# EAGLE design rc64kram62256ram (EAGLE 9.6.2)
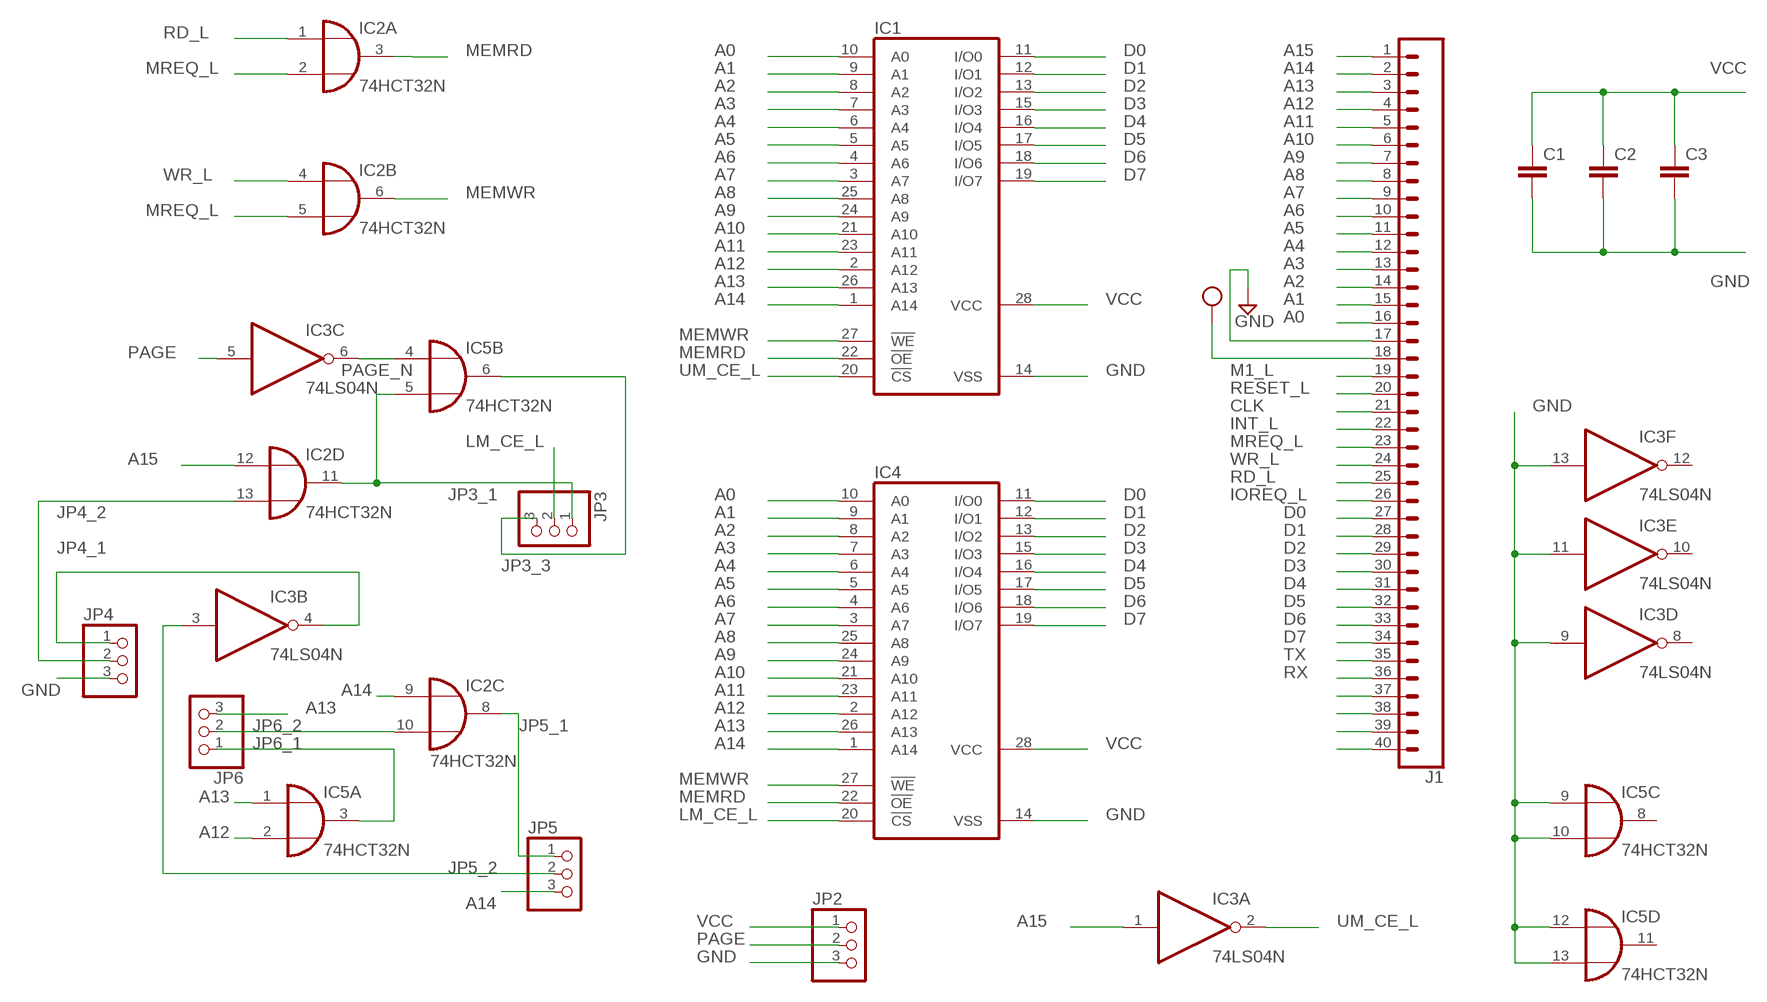
[diagram p0: schematic, sheet 1]

## Parts
C1  C-EU050-025X075  [C050-025X075]
C2  C-EU050-025X075  [C050-025X075]
C3  C-EU050-025X075  [C050-025X075]
IC1  62256P  [DIL28-6]
IC2  74HCT32N  [DIL14]
IC3  74LS04N  [DIL14]
IC4  62256P  [DIL28-6]
IC5  74HCT32N  [DIL14]
J1  CONN_40OFFSET  [1X40_OFFSET]
JP2  PINHD-1X3  [1X03]
JP3  PINHD-1X3  [1X03]
JP4  PINHD-1X3  [1X03]
JP5  PINHD-1X3  [1X03]
JP6  PINHD-1X3  [1X03]

## Nets
A0: IC1.10(A0) IC4.10(A0) J1.16
A1: IC1.9(A1) IC4.9(A1) J1.15
A2: IC1.8(A2) IC4.8(A2) J1.14
A3: IC1.7(A3) IC4.7(A3) J1.13
A4: IC1.6(A4) IC4.6(A4) J1.12
A5: IC1.5(A5) IC4.5(A5) J1.11
A6: IC1.4(A6) IC4.4(A6) J1.10
A7: IC1.3(A7) IC4.3(A7) J1.9
A8: IC1.25(A8) IC4.25(A8) J1.8
A9: IC1.24(A9) IC4.24(A9) J1.7
A10: IC1.21(A10) IC4.21(A10) J1.6
A11: IC1.23(A11) IC4.23(A11) J1.5
A12: IC1.2(A12) IC4.2(A12) IC5.2(A:I1) J1.4
A13: IC1.26(A13) IC4.26(A13) IC5.1(A:I0) J1.3 JP6.3
A14: IC1.1(A14) IC2.9(C:I0) IC4.1(A14) J1.2 JP5.3
A15: IC2.12(D:I0) IC3.1(A:I) J1.1
CLK: J1.21
D0: IC1.11(I/O0) IC4.11(I/O0) J1.27
D1: IC1.12(I/O1) IC4.12(I/O1) J1.28
D2: IC1.13(I/O2) IC4.13(I/O2) J1.29
D3: IC1.15(I/O3) IC4.15(I/O3) J1.30
D4: IC1.16(I/O4) IC4.16(I/O4) J1.31
D5: IC1.17(I/O5) IC4.17(I/O5) J1.32
D6: IC1.18(I/O6) IC4.18(I/O6) J1.33
D7: IC1.19(I/O7) IC4.19(I/O7) J1.34
GND: C1.2 C2.2 C3.2 IC1.14(VSS) IC3.9(D:I) IC3.11(E:I) IC3.13(F:I) IC4.14(VSS) IC5.9(C:I0) IC5.10(C:I1) IC5.12(D:I0) IC5.13(D:I1) J1.17 JP2.3 JP4.3
INT_L: J1.22
IOREQ_L: J1.26
JP3_1: IC2.11(D:O) IC5.5(B:I1) JP3.1
JP3_3: IC5.6(B:O) JP3.3
JP4_1: IC3.4(B:O) JP4.1
JP4_2: IC2.13(D:I1) JP4.2
JP5_1: IC2.8(C:O) JP5.1
JP5_2: IC3.3(B:I) JP5.2
JP6_1: IC5.3(A:O) JP6.1
JP6_2: IC2.10(C:I1) JP6.2
LM_CE_L: IC4.20(!CS) JP3.2
M1_L: J1.19
MEMRD: IC1.22(!OE) IC2.3(A:O) IC4.22(!OE)
MEMWR: IC1.27(!WE) IC2.6(B:O) IC4.27(!WE)
MREQ_L: IC2.2(A:I1) IC2.5(B:I1) J1.23
N$1: J1.37
N$2: J1.38
N$3: J1.39
N$13: J1.40
PAGE: IC3.5(C:I) JP2.2
PAGE_N: IC3.6(C:O) IC5.4(B:I0)
RD_L: IC2.1(A:I0) J1.25
RESET_L: J1.20
RX: J1.36
TX: J1.35
UM_CE_L: IC1.20(!CS) IC3.2(A:O)
VCC: C1.1 C2.1 C3.1 IC1.28(VCC) IC4.28(VCC) J1.18 JP2.1
WR_L: IC2.4(B:I0) J1.24
Unconnected: IC3.8(D:O) IC3.10(E:O) IC3.12(F:O) IC5.8(C:O) IC5.11(D:O)

## Power pins joined to a net without a drawn wire
GND: IC2.7(P:GND) IC3.7(P:GND) IC5.7(P:GND)
VCC: IC2.14(P:VCC) IC3.14(P:VCC) IC5.14(P:VCC)

## Library data of the parts
C1-C3 = LabE:C-EU: CAPACITOR, European symbol; SPICEPREFIX: C
IC1 IC4 = memory-hitachi:62256P: MEMORY; OC_FARNELL: unknown; OC_NEWARK: unknown
IC2 IC5 = 74xx-eu:74*32: Quad 2-input OR gate
IC3 = 74xx-eu:74*04: Hex INVERTER
J1 = SparkFun-Connectors:CONN_40: Multi connection point. Often used as Generic Header-pin footprint for 0.1 inch spaced/style header connections On any of the 0.1 inch spaced packages, you can populate with these: Break Away Headers - Straight <https://www.sparkfun.com/products/116> (PRT-00116) Break Away Male Headers - Right Angle <https://www.sparkfun.com/products/553> (PRT-00553) Female Headers <https://www.sparkfun.com/products/115> (PRT-00115) Break Away Headers - Machine Pin <https://www.sparkfun.com/products/117> (PRT-00117) Break Away Female Headers - Swiss Machine Pin <https://www.sparkfun.com/products/743> (PRT-00743) For SCREWTERMINALS and SPRING TERMINALS visit here: Screw Terimnals on SparkFun.com <https://www.sparkfun.com/search/results?term=Screw+Terminals> (5mm/3.5mm/2.54mm spacing) This device is also useful as a general connection point to wire up your design to another part of your project. Our various solder wires solder well into these plated through hole pads. Hook-Up Wire - Assortment (Stranded, 22 AWG) <https://www.sparkfun.com/products/11375> (PRT-11375) Hook-Up Wire - Assortment (Solid Core, 22 AWG) <https://www.sparkfun.com/products/11367> (PRT-11367) View the entire wire category on our website here <https://www.sparkfun.com/categories/141> Special notes: Molex polarized connector foot print use with SKU : PRT-08231 with associated crimp pins and housings. 1MM SMD Version SKU: PRT-10208 NOTES ON THE VARIANTS LOCK and LOCK_LONGPADS... This footprint was designed to help hold the alignment of a through-hole component (i.e. 6-pin header) while soldering it into place. You may notice that each hole has been shifted either up or down by 0.005 of an inch from it's more standard position (which is a perfectly straight line). This slight alteration caused the pins (the squares in the middle) to touch the edges of the holes. Because they are alternating, it causes a "brace" to hold the component in place. 0.005 has proven to be the perfect amount of "off-center" position when using our standard breakaway headers. Although looks a little odd when you look at the bare footprint, once you have a header in there, the alteration is very hard to notice. Also,if you push a header all the way into place, it is covered up entirely on the bottom side.
JP2-JP6 = pinhead:PINHD-1X3: PIN HEADER

## Board
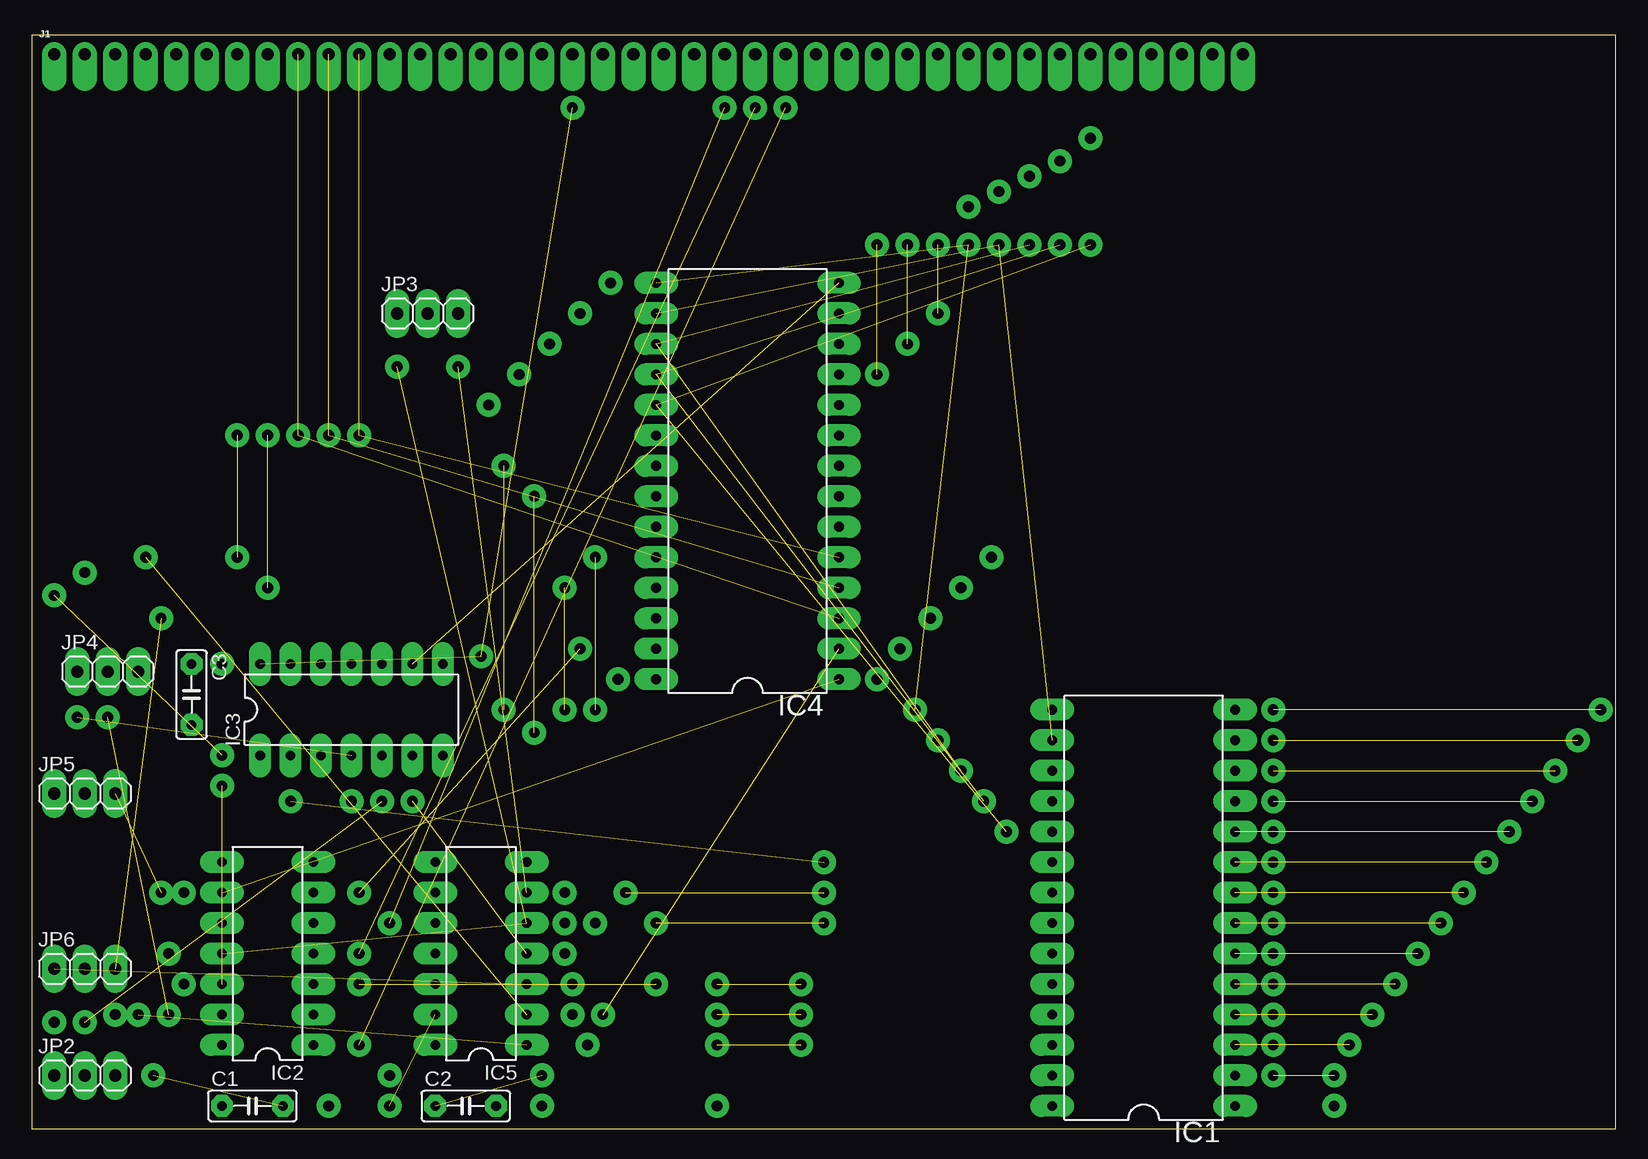
[diagram p1: board, top side]
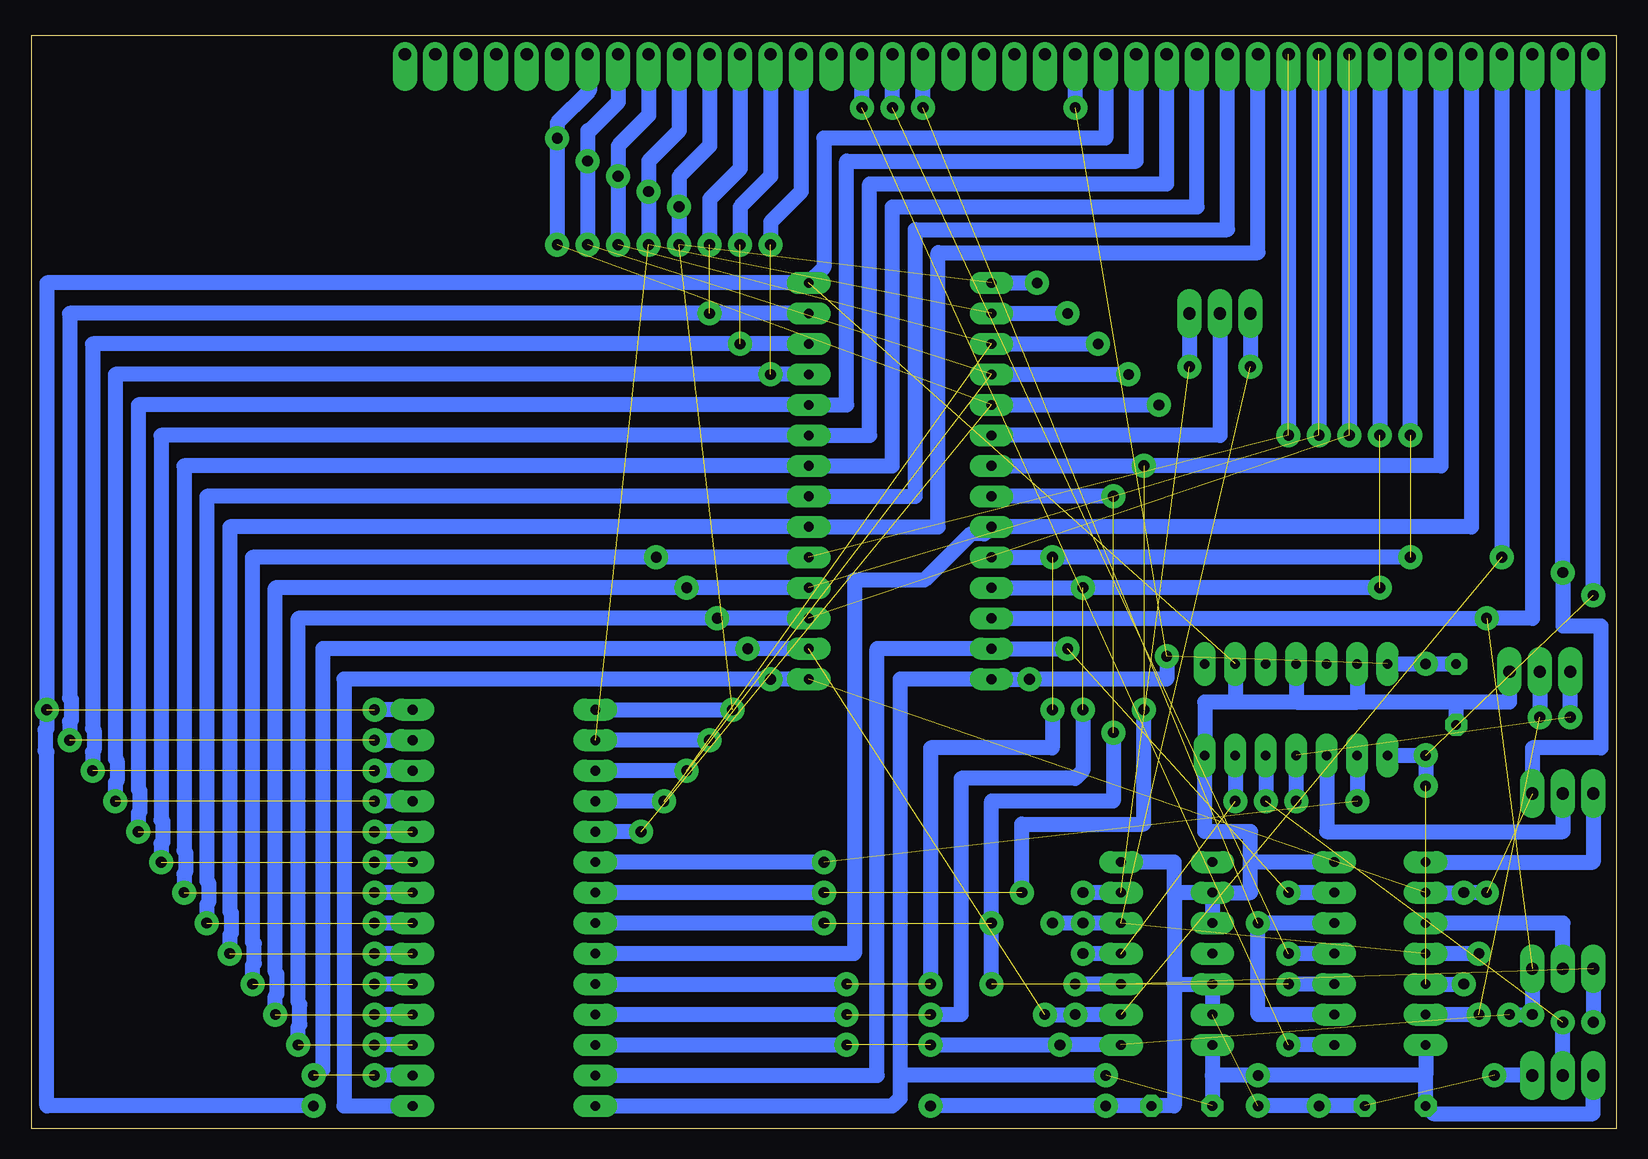
[diagram p2: board, bottom side, seen from below]

Size 132.06 x 91.11 mm. Coordinates in mm from the lower left corner, seen from the top.
Outline: 0,0 132.06,0 132.06,91.11 0,91.11 0,0
Copper layers (1*16): Top 0.035mm / dielectric 1.5mm / Bottom 0.035mm
Design rules "LabE": minimum track width 50mil, minimum drill 0.8mm, track to track 16mil, track to pad 16mil, pad to pad 16mil, via to via 16mil, smd to smd 16mil, copper to edge 0mil, drill to drill 16mil, minimum pad ring 20mil, minimum via ring 20mil, stop-mask expansion 4mil, vias tented up to drill 0mil, thermal gap 10mil

### Footprints (pad centres in the part's own frame; a part is rotated, then mirrored left to right if it is on the bottom)
C050-025X075 = drill 0.813 octagon: 1 -2.54,0; 2 2.54,0
DIL28-6 = drill 0.813 long: 1 -16.51,-7.62; 2 -13.97,-7.62; 3 -11.43,-7.62; 4 -8.89,-7.62; 5 -6.35,-7.62; 6 -3.81,-7.62; 7 -1.27,-7.62; 8 1.27,-7.62; 9 3.81,-7.62; 10 6.35,-7.62; 11 8.89,-7.62; 12 11.43,-7.62; 13 13.97,-7.62; 14 16.51,-7.62; 15 16.51,7.62; 16 13.97,7.62; 17 11.43,7.62; 18 8.89,7.62; 19 6.35,7.62; 20 3.81,7.62; 21 1.27,7.62; 22 -1.27,7.62; 23 -3.81,7.62; 24 -6.35,7.62; 25 -8.89,7.62; 26 -11.43,7.62; 27 -13.97,7.62; 28 -16.51,7.62
DIL14 = drill 0.813 long: 1 -7.62,-3.81; 2 -5.08,-3.81; 3 -2.54,-3.81; 4 0,-3.81; 5 2.54,-3.81; 6 5.08,-3.81; 7 7.62,-3.81; 8 7.62,3.81; 9 5.08,3.81; 10 2.54,3.81; 11 0,3.81; 12 -2.54,3.81; 13 -5.08,3.81; 14 -7.62,3.81
1X40_OFFSET = drill 1.016 pad 1.88 offset: 1 0,0; 2 2.54,0; 3 5.08,0; 4 7.62,0; 5 10.16,0; 6 12.7,0; 7 15.24,0; 8 17.78,0; 9 20.32,0; 10 22.86,0; 11 25.4,0; 12 27.94,0; 13 30.48,0; 14 33.02,0; 15 35.56,0; 16 38.1,0; 17 40.64,0; 18 43.18,0; 19 45.72,0; 20 48.26,0; 21 50.8,0; 22 53.34,0; 23 55.88,0; 24 58.42,0; 25 60.96,0; 26 63.5,0; 27 66.04,0; 28 68.58,0; 29 71.12,0; 30 73.66,0; 31 76.2,0; 32 78.74,0; 33 81.28,0; 34 83.82,0; 35 86.36,0; 36 88.9,0; 37 91.44,0; 38 93.98,0; 39 96.52,0; 40 99.06,0
1X03 = drill 1.016 long: 1 -2.54,0; 2 0,0; 3 2.54,0

### Placement (x,y rotation side)
C1  18.41,1.91 0 top
C2  36.2,1.91 0 top
C3  13.34,36.2 270 top
IC1  92.71,18.41 90 top
IC2  19.68,14.61 90 top
IC3  26.67,34.92 0 top
IC4  59.69,53.98 90 top
IC5  37.47,14.61 90 top
J1  1.91,89.53 0 top
JP2  4.45,4.45 0 top
JP3  33.02,67.94 0 top
JP4  6.35,38.1 0 top
JP5  4.45,27.94 0 top
JP6  4.45,13.34 0 top

### Tracks (layer width: path | path; a pad name or v marks a point on that pad's centre or on a via)
A0  (via drill 0.9 pad 2)  (2 unrouted)
  Bottom 1.27: IC1.10 v103.5,24.77 | J1.16 40.01,80.64 64.14,80.64 64.14,60.33 IC4.10 123.19,60.33 123.19,28.29 123.05,28.15 123.05,26.46 123.19,26.32 v123.19,24.77
A1  (via drill 0.9 pad 2)  (2 unrouted)
  Bottom 1.27: IC1.9 v103.5,22.23 | J1.15 37.47,78.74 62.23,78.74 62.23,57.78 IC4.9 121.28,57.78 121.28,25.75 121.15,25.61 121.15,23.92 121.28,23.78 v121.28,22.23
A2  (via drill 0.9 pad 2)  (2 unrouted)
  Bottom 1.27: IC1.8 v103.5,19.68 | J1.14 34.92,76.83 60.33,76.83 60.33,55.24 IC4.8 119.38,55.24 119.38,23.21 119.24,23.07 119.24,21.38 119.38,21.24 v119.38,19.68
A3  (via drill 0.9 pad 2)  (2 unrouted)
  Bottom 1.27: IC1.7 v103.5,17.14 | J1.13 32.38,74.93 58.42,74.93 58.42,52.7 IC4.7 117.47,52.7 117.47,20.67 117.34,20.53 117.34,18.84 117.47,18.7 v117.47,17.14
A4  (via drill 0.9 pad 2)  (2 unrouted)
  Bottom 1.27: IC1.6 v103.5,14.61 | J1.12 29.84,73.03 56.52,73.03 56.52,50.16 IC4.6 115.57,50.16 115.57,18.13 115.43,17.99 115.43,16.3 115.57,16.16 v115.57,14.61
A5  (via drill 0.9 pad 2)  (5 unrouted)
  Bottom 1.27: IC4.5 v80.01,47.62 113.67,47.62 113.67,15.59 113.53,15.45 113.53,13.76 113.67,13.62 v113.67,12.06 | IC1.5 v103.5,12.06 | J1.11 v27.3,57.78
A6  (via drill 0.9 pad 2)  (5 unrouted)
  Bottom 1.27: IC4.4 v77.47,45.09 111.76,45.09 111.76,13.05 111.62,12.91 111.62,11.22 111.76,11.08 v111.76,9.53 | IC1.4 v103.5,9.53 | J1.10 v24.77,57.78
A7  (via drill 0.9 pad 2)  (5 unrouted)
  Bottom 1.27: IC4.3 v74.93,42.55 109.86,42.55 109.86,10.51 109.72,10.37 109.72,8.68 109.86,8.54 v109.86,6.99 | IC1.3 v103.5,6.99 | J1.9 v22.23,57.78
A8  (via drill 0.9 pad 2)  (3 unrouted)
  Bottom 1.27: J1.8 v19.68,57.78 | v64.14,9.53 IC1.25 | v19.68,45.09 v44.45,45.09 IC4.25 | v44.45,34.92 44.45,29.84 45.09,29.21 54.61,29.21 54.61,9.53 v57.15,9.53
A9  (via drill 0.9 pad 2)  (3 unrouted)
  Bottom 1.27: v17.14,57.78 J1.7 | v17.14,47.62 v46.99,47.62 IC4.24 | IC1.24 v64.14,12.06 | v46.99,34.92 46.99,31.75 57.15,31.75 v57.15,12.06
A10  (via drill 0.9 pad 2)  (2 unrouted)
  Bottom 1.27: J1.6 14.61,55.24 v39.37,55.24 IC4.21 | v66.04,19.68 IC1.21 | v49.53,19.68 49.53,25.4 39.37,25.4 v39.37,34.92
A11
  Bottom 1.27: J1.5 12.06,50.16 IC4.23 52.65,49.58 53.8,49.58 57.66,45.72 63.5,45.72 63.5,14.61 IC1.23
A12  (via drill 0.9 pad 2)  (3 unrouted)
  Bottom 1.27: IC4.2 v72.39,40.01 107.81,40.01 107.81,4.94 108.45,4.31 v108.58,4.45 | IC1.2 v103.5,4.45 | J1.4 v9.53,47.62 | IC5.2 v45.09,9.53 v47.62,9.53
A13  (via drill 0.9 pad 2)  (3 unrouted)
  Bottom 1.27: IC1.26 v64.14,6.99 | J1.3 6.99,42.55 v10.79,42.55 IC4.26 | IC5.1 v46.35,6.99 v57.15,6.99 | JP6.3 v6.99,9.53 v8.89,9.53
A14  (via drill 0.9 pad 2)  (2 unrouted)
  Bottom 1.27: IC4.1 v70.48,37.47 106.05,37.47 106.05,1.91 IC1.1 | J1.2 v4.45,46.35 4.45,41.91 1.27,41.91 1.27,31.75 6.99,31.75 JP5.3 | IC2.9 v12.7,19.68 v10.79,19.68
A15  (via drill 0.9 pad 2)  (2 unrouted)
  Bottom 1.27: v1.91,44.45 J1.1 | IC3.1 v15.88,31.11 v15.88,28.57 | IC2.12 v12.7,12.06
D0  (via drill 0.9 pad 2)  (2 unrouted)
  Bottom 1.27: IC4.11 v70.48,62.87 125.09,62.87 125.09,30.83 124.96,30.69 124.96,29 125.09,28.86 v125.09,27.3 | IC1.11 v103.5,27.3 | J1.27 67.94,78.11 70.48,75.56 v70.48,73.66
D1  (via drill 0.9 pad 2)  (2 unrouted)
  Bottom 1.27: IC4.12 v73.03,65.41 127,65.41 127,33.37 126.86,33.23 126.86,31.54 127,31.4 v127,29.84 | IC1.12 v103.5,29.84 | J1.28 70.48,79.38 73.03,76.83 v73.03,73.66
D2  (via drill 0.9 pad 2)  (2 unrouted)
  Bottom 1.27: IC4.13 v75.56,67.94 128.91,67.94 128.91,35.91 128.77,35.77 128.77,34.08 128.91,33.94 v128.91,32.38 | v103.5,32.38 IC1.13 | v75.56,73.66 75.56,77.47 73.03,80.01 J1.29
D3  (via drill 0.9 pad 2)  (2 unrouted)
  Bottom 1.27: IC4.15 v48.26,70.48 | IC1.15 v73.66,34.92 | J1.30 75.56,81.92 78.11,79.38 v78.11,76.83 v78.11,73.66
D4  (via drill 0.9 pad 2)  (2 unrouted)
  Bottom 1.27: IC4.16 v45.72,67.94 | v75.56,32.38 IC1.16 | J1.31 78.11,83.19 80.64,80.64 v80.64,78.11 v80.64,73.66
D5  (via drill 0.9 pad 2)  (2 unrouted)
  Bottom 1.27: IC4.17 v43.18,65.41 | v77.47,29.84 IC1.17 | J1.32 80.64,84.45 83.19,81.92 v83.19,79.38 v83.19,73.66
D6  (via drill 0.9 pad 2)  (2 unrouted)
  Bottom 1.27: IC4.18 v40.64,62.87 | v79.38,27.3 IC1.18 | J1.33 83.19,85.56 85.56,83.19 85.72,83.19 v85.72,80.64 v85.72,73.66
D7  (via drill 0.9 pad 2)  (2 unrouted)
  Bottom 1.27: IC4.19 v38.1,60.33 | v81.28,24.77 IC1.19 | J1.34 85.57,89.38 85.57,86.51 88.27,83.82 v88.27,82.55 v88.27,73.66
GND  (via drill 0.9 pad 2)  (4 unrouted)
  Bottom 1.27: IC1.14 v103.5,34.92 | J1.17 42.55,82.55 66.04,82.55 66.04,71.75 IC4.14 130.81,70.48 v130.81,34.92 130.81,33.37 130.95,33.23 130.95,31.54 130.81,31.4 130.81,1.91 v108.58,1.91 | IC5.9 IC5.10 | IC5.13 IC5.12 36.83,12.06 | IC5.9 36.83,19.68 | 36.83,19.68 36.83,22.23 IC5.7 | 36.83,19.68 36.83,12.06 | IC3.9 31.75,35.56 | 31.75,35.56 34.29,35.56 IC3.7 34.29,24.77 30.48,24.77 30.48,22.23 | IC3.11 26.67,35.56 | 26.67,35.56 31.75,35.56 | IC3.13 21.59,35.56 | 26.67,35.56 21.59,35.56 | 13.34,35.56 8.89,35.56 JP4.3 | 13.34,35.56 21.59,35.56 | IC2.7 30.48,22.23 | IC5.9 30.48,19.68 30.48,22.23 | C3.2 13.34,35.56 | 36.83,12.06 36.83,1.91 C2.2 v42.55,1.91 v57.15,1.91 | JP2.3 v10.16,4.45 | C1.2 v24.77,1.91 v29.84,1.91
JP3_1  (via drill 0.9 pad 2)  (2 unrouted)
  Bottom 1.27: JP3.1 v30.48,63.5 | IC5.5 v44.45,17.14 v46.99,17.14 | v11.43,14.61 IC2.11
JP3_3  (via drill 0.9 pad 2)  (1 unrouted)
  Bottom 1.27: JP3.3 v35.56,63.5 | IC5.6 v44.45,19.68
JP4_1  (via drill 0.9 pad 2)  (1 unrouted)
  Bottom 1.27: v3.81,34.29 JP4.1 | v26.67,27.3 IC3.4
JP4_2  (via drill 0.9 pad 2)  (1 unrouted)
  Bottom 1.27: JP4.2 v6.35,34.29 | v11.43,9.53 IC2.13
JP5_1
  Bottom 1.27: JP5.1 1.91,22.23 IC2.8
JP5_2
  Bottom 1.27: JP5.2 4.45,24.77 24.13,24.77 IC3.3
JP6_1  (via drill 0.9 pad 2)  (1 unrouted)
  Bottom 1.27: IC5.3 v45.09,12.06 | JP6.1 v1.91,8.89
JP6_2
  Bottom 1.27: JP6.2 4.45,17.14 IC2.10
LM_CE_L
  Bottom 1.27: IC4.20 33.02,57.78 JP3.2
MEMRD  (via drill 0.9 pad 2)  (3 unrouted)
  Bottom 1.27: v41.91,52.7 IC4.22 | v66.04,17.14 IC1.22 | v41.91,33.02 41.91,27.3 52.07,27.3 v52.07,17.14 v52.07,12.06 | IC2.3 v27.3,12.06
MEMWR  (via drill 0.9 pad 2)  (1 unrouted)
  Bottom 1.27: IC1.27 61.59,4.45 61.59,40.01 IC4.27 v45.72,40.01 | IC2.6 v27.3,19.68
MREQ_L  (via drill 0.9 pad 2)  (1 unrouted)
  Bottom 1.27: v57.78,85.09 J1.23 | IC2.5 v29.84,17.14 29.84,9.53 IC2.2
PAGE  (via drill 0.9 pad 2)  (1 unrouted)
  Bottom 1.27: JP2.2 v4.45,8.89 | IC3.5 v29.21,27.3
PAGE_N  (via drill 0.9 pad 2)  (1 unrouted)
  Bottom 1.27: IC5.4 v44.45,14.61 | IC3.6 v31.75,27.3
RD_L  (via drill 0.9 pad 2)  (1 unrouted)
  Bottom 1.27: v62.87,85.09 J1.25 | IC2.1 v27.3,6.99
UM_CE_L  (via drill 0.9 pad 2)  (1 unrouted)
  Bottom 1.27: IC3.2 v21.59,27.3 | v66.04,22.23 IC1.20
VCC  (via drill 0.9 pad 2)  (3 unrouted)
  Bottom 1.27: v45.09,85.09 J1.18 | 59.69,4.45 59.69,37.47 IC4.28 v48.9,37.47 37.47,37.47 v37.47,39.37 | 59.69,4.45 59.69,2.54 60.33,1.91 IC1.28 | IC3.14 v15.88,38.73 C3.1 | IC2.14 15.88,4.45 | IC5.14 33.66,4.45 | JP2.1 1.91,1.27 15.24,1.27 C1.1 15.88,4.45 | 15.88,4.45 v29.84,4.45 33.66,4.45 | v42.55,4.45 59.69,4.45 | 33.66,4.45 C2.1
WR_L  (via drill 0.9 pad 2)  (1 unrouted)
  Bottom 1.27: v60.33,85.09 J1.24 | IC2.4 v27.3,14.61